# Altium project MC Alarm.PrjPcb
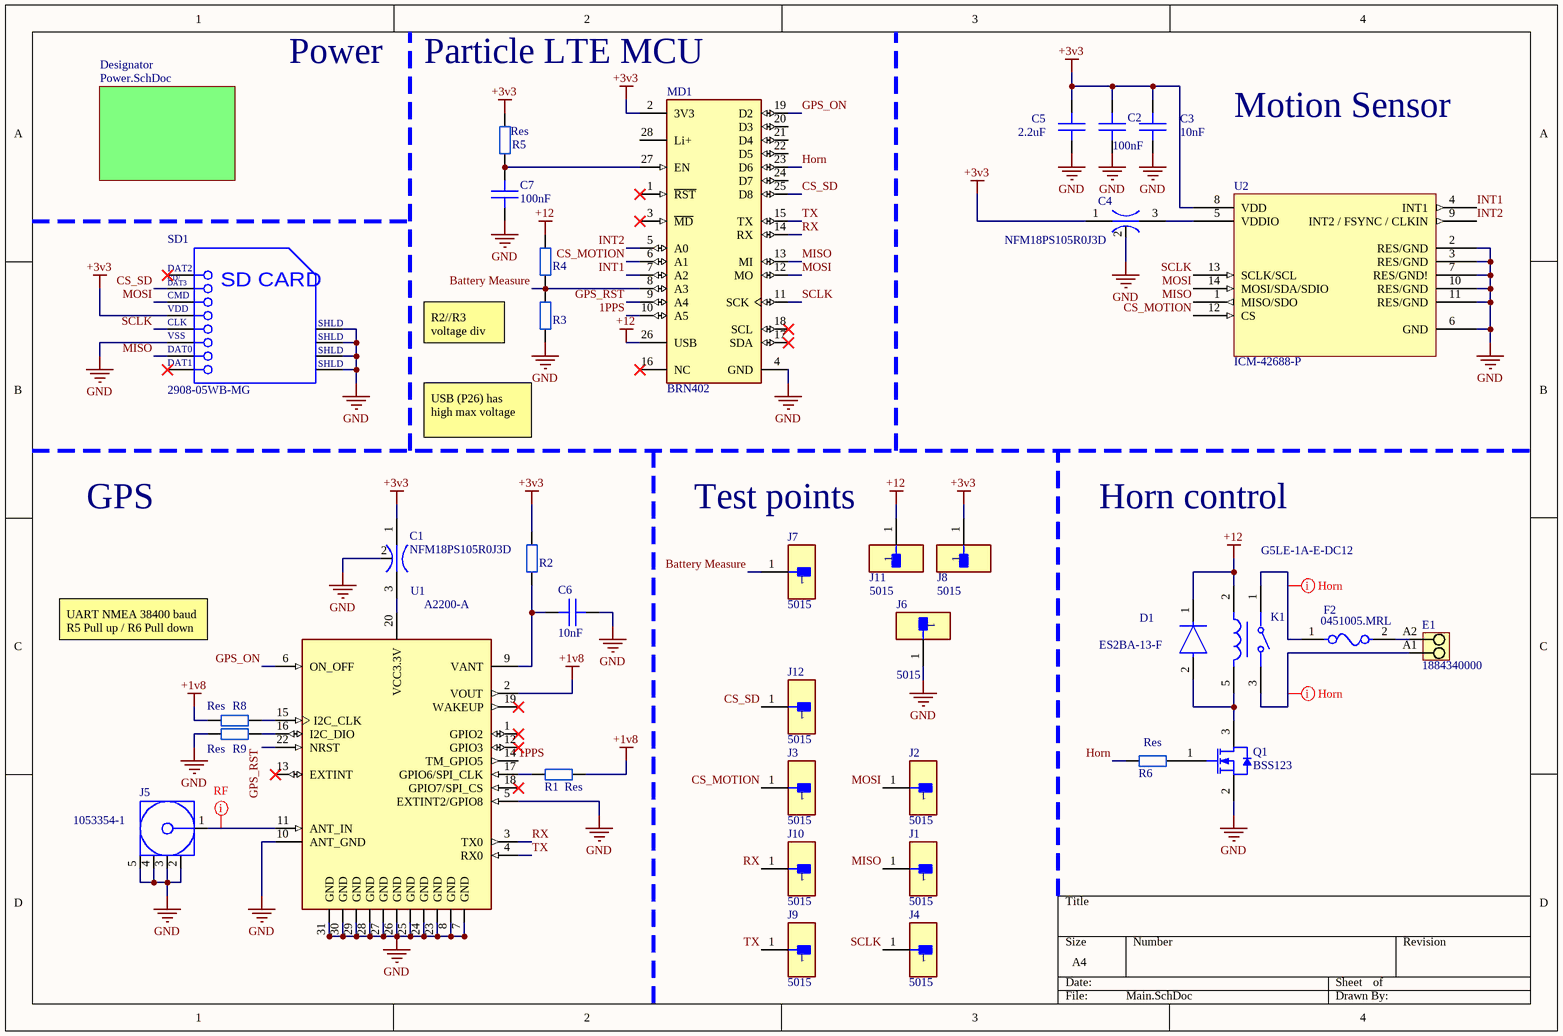
[diagram p0: Main.SchDoc]
2 sheets, 44 parts. Net scope: global (net labels, ports and power ports of the same name join across sheets).
Board file: PCB.PcbDoc
Sheets:
  Main.SchDoc
    Designator = Power.SchDoc

## Sheet Main.SchDoc
size A4; SheetNumber: 1; SheetTotal: 2

### Parts
C1  NFM18PS105R0J3D  [FP-NFM18-0_1-e0_05_0_35-MFG]
C2  value 100nF  [C0603 (1608)]  (hidden comment: Cap SMD)
C3  value 10nF  [C0603 (1608)]  (hidden comment: Cap SMD)
C4  NFM18PS105R0J3D  [FP-NFM18-0_1-e0_05_0_35-MFG]
C5  value 2.2uF  [C0603 (1608)]  (hidden comment: Cap SMD)
C6  value 10nF  [C0603 (1608)]  (hidden comment: Cap SMD)
C7  value 100nF  [C0603 (1608)]  (hidden comment: Cap SMD)
D1  ES2BA-13-F  [FP-SMA-MFG]
E1  1884340000  [LSF_SMT_5_00_135_02]
F2  0451005.MRL  [FP-0451-MFG]
J1  5015  [FP-5015-MFG]
J2  5015  [FP-5015-MFG]
J3  5015  [FP-5015-MFG]
J4  5015  [FP-5015-MFG]
J5  1053354-1  [TECO-1053354-1_V]
J6  5015  [FP-5015-MFG]
J7  5015  [FP-5015-MFG]
J8  5015  [FP-5015-MFG]
J9  5015  [FP-5015-MFG]
J10  5015  [FP-5015-MFG]
J11  5015  [FP-5015-MFG]
J12  5015  [FP-5015-MFG]
K1  G5LE-1A-E-DC12  [FP-G5LE-1A-E-DC12-MFG]
MD1  BRN402  [FP-BRN402-0]
Q1  BSS123  [FAIR-SOT23-3_V]
R1  Res  [R0603 (1608)]
R2  Res  [R0603 (1608)]  (value not drawn)
R3  Res  [R0603 (1608)]  (value not drawn)
R4  Res  [R0603 (1608)]  (value not drawn)
R5  Res  [R0603 (1608)]
R6  Res  [R0603 (1608)]
R8  Res  [R0603 (1608)]
R9  Res  [R0603 (1608)]
SD1  2908-05WB-MG  [3M-2908-05WB-MG_V]
U1  A2200-A  [XCVR_A2200-A]
U2  ICM-42688-P  [ICM-42688-P]

### Sub-sheets
Designator = Power.SchDoc: no entries

### Nets
+1v8: R1.1 R8.2 U1.2(VOUT)
+3v3: C1.1(Input) C2.2 C3.2 C4.1(Input) C5.2 J8.1 MD1.2(3V3) R2.2 R5.2 SD1.4(VDD) U2.8(VDD)
+12: D1.1(C) J11.1 K1.2 MD1.26(USB) R4.2
GND: C1.2(GND) C2.1 C3.1 C4.2(GND) C5.1 C6.1 C7.1 J5.2 J5.3 J5.4 J5.5 J6.1 MD1.4(GND) Q1.2(S) R3.1 R9.2 SD1.6(VSS) SD1.9(SHLD) SD1.10(SHLD) SD1.11(SHLD) SD1.12(SHLD) U1.5(EXTINT2/GPIO8) U1.7(GND) U1.8(GND) U1.10(ANT_GND) U1.23(GND) U1.24(GND) U1.25(GND) U1.26(GND) U1.27(GND) U1.28(GND) U1.29(GND) U1.30(GND) U1.31(GND) U2.2(RES/GND) U2.3(RES/GND) U2.6(GND) U2.7(RES/GND!) U2.10(RES/GND) U2.11(RES/GND)
1PPS: MD1.10(A5) U1.14(TM_GPIO5)
Battery Measure: J7.1 MD1.8(A3) R3.2 R4.1
CS_MOTION: J3.1 MD1.6(A1) U2.12(CS)
CS_SD: J12.1 MD1.25(D8) SD1.2(CD/DAT3)
GPS_ON: MD1.19(D2) U1.6(ON_OFF)
GPS_RST: MD1.9(A4) U1.22(NRST)
Horn: MD1.23(D6) R6.2
INT1: MD1.7(A2) U2.4(INT1)
INT2: MD1.5(A0) U2.9(INT2_/_FSYNC_/_CLKIN)
MISO: J1.1 MD1.13(MI) SD1.7(DAT0) U2.1(MISO/SDO)
MOSI: J2.1 MD1.12(MO) SD1.3(CMD) U2.14(MOSI/SDA/SDIO)
RX: J10.1 MD1.14(RX) U1.3(TX0)
SCLK: J4.1 MD1.11(SCK) SD1.5(CLK) U2.13(SCLK/SCL)
TX: J9.1 MD1.15(TX) U1.4(RX0)
NetC1_3: C1.3(Output) U1.20(VCC3.3V)
NetC4_3: C4.3(Output) U2.5(VDDIO)
NetC6_2: C6.2 R2.1 U1.9(VANT)
NetC7_2: C7.2 MD1.27(EN) R5.1
NetD1_2: D1.2(A) K1.5 Q1.3(D)
NetE1_A1: E1.A1 K1.3
NetE1_A2: E1.A2 F2.2
NetF2_1: F2.1 K1.1
NetJ5_1: J5.1 U1.11(ANT_IN)
NetQ1_1: Q1.1(G) R6.1
NetR1_2: R1.2 U1.17(GPIO6/SPI_CLK)
NetR8_1: R8.1 U1.15(I2C_CLK)
NetR9_1: R9.1 U1.16(I2C_DIO)

Not connected (* = marked no-connect by the designer): MD1 1(~{RST})* 3(~{MD})* 16(NC)* 17(SDA)* 18(SCL)* 20(D3) 21(D4) 22(D5) 24(D7) 28(Li+); SD1 1(DAT2)* 8(DAT1)*; U1 1(GPIO2)* 12(GPIO3)* 13(EXTINT)* 18(GPIO7/SPI_CS)* 19(WAKEUP)*

### Layout directives
net class High Power: NetE1_A1, NetF2_1
net class RF: NetJ5_1

### Notes on the sheet
- Power
- Particle LTE MCU
- Motion Sensor
- R2//R3 voltage div
- USB (P26) has high max voltage
- GPS
- (near J11) Test points
- Horn control
- UART NMEA 38400 baud
  R5 Pull up / R6 Pull down
- (in symbol CMP-2000-05030-1) CD/; DAT3; SD CARD

### Library data of the parts
C1 C4 = CMP-2000-06844-3: Large Current 3 Terminals Low ESL Chip Multilayer Ceramic Capacitors for General Purpose, 0603, 1uF, 20%, 6.3V; Current Rating: 2A; DC Resistance (DCR): 30mR; Insulation Resistance: 500MR; Max Voltage Rating (DC): 6.3V; Voltage: 6.3V; Weight: 7.1E-05oz; Height: 0.6mm; Lead Free: Lead Free; REACH SVHC: No SVHC; Max Operating Temperature: 105°C; Min Operating Temperature: -55°C; Mount: Surface Mount; Capacitance: 1uF; Width: 0.8mm; Radiation Hardening: No; Max Current Rating: 2A; Case Code (Imperial): 0603; Voltage Rating (DC): 6.3V; Length: 1.6mm; Case/Package: 0603; Case Code (Metric): 1608; Package Quantity: 1; Tolerance: 20%; Current: 2A; Packaging: Tape and Reel; Depth: 0.8mm; Voltage Rating: 6.3V; Termination: Flat
D1 = CMP-12791-000037-1: DIODE GEN PURP 100V 2A SMA; Manufacturer: Diodes Inc.; Standoff Height: 0.05mm; Value: 25pF; Peak Reverse Current: 5uA; Max Junction Temp: +150°C; Max Surge Forward Current: 50A; Digikey Description: DIODE GEN PURP 100V 2A SMA; Max Repetitive Reverse Voltage: 100V; Mouser Description: ES2BA Series 100 V 2 A Surface Mount Super-Fast Rectifier - DO-214AC; RoHS: TRUE; Device Class L3: Rectifier Diodes; Height: 2.4mm; Footprint Url: https://www.diodes.com/assets/Package-Files/SMA.pdf; Lead Free: Yes; Device Class L1: Discrete Semiconductors; Forward Current: 2A; ComponentLink2Description: Datasheet; Manufacturer Part Number: ES2BA-13-F; Temperature: -55°C to +150°C; Temperature Range Low: -55°C; Automotive: No; Device Class L2: Diodes; Category: Diode; Octopart: https://octopart.com/es2ba-13-f-diodes+inc.-14402013; Package: SMA; Capacitance: 25pF; ComponentLink2URL: https://www.diodes.com/assets/Datasheets/ds14002.pdf; Reverse Voltage: 100V; Temperature Range High: +150°C
E1 = CMP-1559-02276-1: OMNIMATE Signal - series LSF; Manufacturer: Weidmueller; Rated_voltage_for_surge_voltage_class_pollution_degree_II_2: 500 V; Pitch_mm: 5 mm; Wire_cross_section_AWG_min_UL_1059: AWG 24; Insulating_material: LCP GF; Rated_voltage_use_group_B_UL_1059: 300 V; Rated_current_use_group_B_UL_1059: 12 A; Mounting_onto_the_PCB: Reflow solder connection; Contact_material: Cu-Leg; Short_text_for_material: LSF-SMT 5.00/02/135 3.5SN BK TU; No_of_poles: 2; UL_94_flammability_rating: V-0; Solid_min_H05_07_V_U: 0,2 mm²; Contact_surface: tinned; Side_termination_characteristic: closed side; Wire_cross_section_AWG_max_UL_1059: AWG 16; Solder_pin_length_mm: 3,5 mm; Pitch_inch: 0,197 inch; Solid_max_H05_07_V_U: 1,5 mm²; Rated_current_min_no_of_poles_TU_20_deg_C: 19 A; Packaging: Tube; ComponentLink1URL: http://www.weidmueller.com/; ComponentLink2URL: http://catalog.weidmueller.com/catalog/Start.do?localeId=en&ObjectID=1884340000; PackageReference: LSF_SMT_5_00_135_02; PartNumber: 1884340000; ComponentLink1Description: Manufacturer URL; Qty: 60 PCS; Colour: Black; Revision: V1; ComponentLink2Description: URL Link1
F2 = CMP-2000-05653-2: FUSE BRD MNT 5A 125VAC/VDC 2SMD; Manufacturer: Littelfuse Inc; Fuse Blow Speed: Fast; Voltage Rating: 125V; Fuse Interrupt Ac Current: 50A; Value: 0.0125Ω; Fuse I2T: 5.566A2Sec; Device Class L3: unset; Temperature Range Low: -55°C; Height: 2.94mm; Category: Fuse; Fuse Current: 5A; Octopart: https://octopart.com/0451005.mrl-littelfuse-566389; Package: 0451; RoHS: TRUE; Manufacturer Part Number: 0451005.MRL; Mouser Description: Surface Mount Fuses 125V 5A; Device Class L2: Fuses; ComponentLink2URL: https://www.littelfuse.com/~/media/electronics/datasheets/fuses/littelfuse_fuse_451_453_datasheet.pdf.pdf; Temperature Range High: +125°C; Digikey Description: FUSE BRD MNT 5A 125VAC/VDC 2SMD; Device Class L1: Circuit Protection; Automotive: No; Fuse Interrupt Dc Current: 50A; Temperature: -55°C to +125°C; Max Fuse Dc Voltage: 125V; Resistance: 0.0125Ω; ComponentLink2Description: Datasheet; Max Fuse Ac Voltage: 125V; Lead Free: Yes
J1-J4 J6-J12 = CMP-2000-05183-2: PC TEST POINT MINIATURE; Manufacturer: keystone; Number Of Contacts: 1; Conn Orientation: Straight; Category: Conn; Manufacturer Part Number: 5015; Digikey Description: PC TEST POINT MINIATURE; Automotive: No; Lead Free: Yes; Octopart: https://octopart.com/5015-keystone-3822; ComponentLink2URL: http://www.keyelco.com/product-pdf.cfm?p=1353; Package: 5015; RoHS: TRUE; Device Class L3: unset; Device Class L2: unset; Contact Material: Silver; Device Class L1: Connectors; Height: 1.65mm; ComponentLink2Description: Datasheet
J5 = CMP-2000-05830-1: Female Coaxial Connector, Pitch 2.55 mm, Height 9.5 mm, Tail Length 3.9 mm, RoHS, Bulk; Manufacturer: TE Connectivity; Dynamic Catalog: SMA; Impedance: 50Ohm; Contact Termination: Solder; Connector Type: Jack,FemaleSockets; 3D Model: 1053354-1.pdf; Other Names: 2062000000 / A30046; Datasheet Version: Rev. B, 05/2011; Package Reference: 1053354-1; RoHS Information: 1053354-1StatementofCompliance; Series: SMA; Connector Style: SMA; Family: CoaxialConnectors(RF); Category: Connectors,Interconnects; Fastening Type: Threaded; Standard Package: 125; Mounting Type: ThroughHole; Packaging: Bulk; Datasheet URL: http://www.te.com/commerce/DocumentDelivery/DDEController?Action=srchrtrv&DocNm=1053354&DocType=Customer+Drawing&DocLang=English; Mounting Technology: ThroughHole; Manufacturer URL: http://www.te.com/; Package Description: Female Coaxial Connector, Pitch 2.55 mm, Height 9.5 mm, Tail Length 3.9 mm
K1 = CMP-08822-000128-1: RELAY GEN PURPOSE SPST 16A 12V; Operate Time: 10ms; Coil Power: 400mW; Coil Current: 33.3mA; Voltage Rating (AC): 250V; Coil Type: Non-Latching; Relay Type: General Purpose; Coil Resistance: 360R; Release Time: 5ms; Packaging: Tray; Lead Free: Lead Free; Coil Voltage (DC): 12V; Max Operating Temperature: 85°C; Max Current Rating: 16A; Series: G5LE; Depth: 16.5mm; Contact Current Rating: 16A; Throw Configuration: SPST; Height: 19mm; Width: 16.5mm; Min Operating Temperature: -40°C; Max Voltage Rating (AC): 250V; Termination: Solder; Length: 22.5mm; Weight: 12g; Number of Pins: 4; Power Consumption: 400mW; Contact Material: Tin; Package Quantity: 100; Mount: Through Hole; RoHS Compliant: Yes
MD1 = CMP-201502-000001-1: BORON LTE; Manufacturer: Particle; Number Of Adc Channels: 6; Data Rate: 2000kbits/s; Max Frequency: 3000MHz; Min Supply Voltage: 3V; Interface: I2C,SPI,UART,USB; Max Supply Voltage: 4.4V; Bandwidth: 2302MHz; Nominal Supply Current: 70-100000uA; Number Of Gpio: 20; Category: UNK; Temperature Range Low: -20°C; Temperature: -20°C to +60°C; Package: BRN402; Automotive: No; Device Class L2: RF Semiconductors and Devices; ComponentLink2Description: Datasheet; Manufacturer Part Number: BRN402; ComponentLink2URL: https://docs.particle.io/assets/pdfs/datasheets/boron-datasheet.pdf; Lead Free: Yes; Device Class L3: Transceivers; RoHS: TRUE; Octopart: https://octopart.com/brn402-particle-96116406; Device Class L1: Integrated Circuits (ICs); Digikey Description: BORON LTE; Temperature Range High: +60°C
Q1 = CMP-2000-04934-1: N-Channel Logic Level Enhancement Mode Field Effect Transistor, 1.7 V, -55 to 150 degC, 3-Pin SOT-23, RoHS, Tape and Reel; Manufacturer: Fairchild; Channel Type: N; Typical Turn-Off Delay Time: 17ns; Maximum Continuous Drain Current: 0.17A; Rad Hard: No; Typical Rise Time: 9ns; Typical Fall Time: 2.4ns; Maximum Gate Source Voltage: ±20V; Maximum Drain Source Voltage: 100V; Typical Turn-On Delay Time: 1.7ns; RDS-on: 6000@10VmOhm; Package Version: Rev. 12, 03/2016; Packaging: Tape&Reel; Package Reference: SOT23-3; Channel Mode: Enhancement; Operating Temperature: -55to150degC; Package Description: 3-Pin Small Outline Transistor, Body 2.92 x 1.325 mm, Pitch 0.95 mm; Category: MOSFET; Datasheet Version: Jun-03; Datasheet URL: https://www.fairchildsemi.com/datasheets/BS/BSS123.pdf; Manufacturer URL: https://www.fairchildsemi.com/; Mounting: SurfaceMount; Package: 3SOT-23; Package URL: http://www.fairchildsemi.com/dwg/MA/MA03D.pdf
R1-R6 R8 R9 = Resistor EU
SD1 = CMP-2000-05030-1: Card Connector Micro-SD, 500 VAC, 100 mOhm Min, 0.5 A, RoHS, Tape and Reel; Manufacturer: 3M; Connector Type: ConnectorandEjector; Other Related Documents: SDCardDateCodeDecipher; Insertion, Removal Method: PushIn,PushOut; Other Names: 3M5607CT; PCN Obsolescence/ EOL: 2908Series30/Jun/2010; Number of Positions: 10(8+2); Card Type: SecureDigital-microSD™; Online Catalog: 2900Series; Featured Product: 3MCardConnectormicroSD; Features: Switch; Packaging: CutTape(CT); Package Reference: 2908-05WB-MG; Package Description: 8-Pin Surface Mount Device, Body 15.2 x 14 mm, Pitch 1.1 mm; Contact Finish: Gold; Catalog Drawings: 2908-05WB-MG; Mounting Feature: Normal,Standard-Top; Series: 2900; Datasheet Version: Oct-06; Datasheet URL: http://datasheet.octopart.com/2908-05WB-MG-3M-datasheet-6398107.pdf; Contact Finish Thickness: 15µin(0.38µm); Manufacturer URL: http://www.3m.com/; Family: MemoryConnectors-PCCardSockets; Category: Connectors,Interconnects; Standard Package: 1; Mounting Type: SurfaceMount,RightAngle; Ejector Side: -; Height Above Board: 0.073"(1.85mm)
U1 = A2200-A: SiRFstarIVâ„¢ RF Receiver GPS 1.575GHz -163dBm 115.2kbps Module; MF: Maestro Wireless; SnapEDA_Link: https://www.snapeda.com/parts/A2200-A/Maestro%20Wireless%20Solutions/view-part/51723/?ref=snap; Availability: Unavailable; MP: A2200-A; Price: None; Value: *; Package: Module Maestro Wireless

## Sheet Power.SchDoc
size A4; SheetNumber: 2; SheetTotal: 2
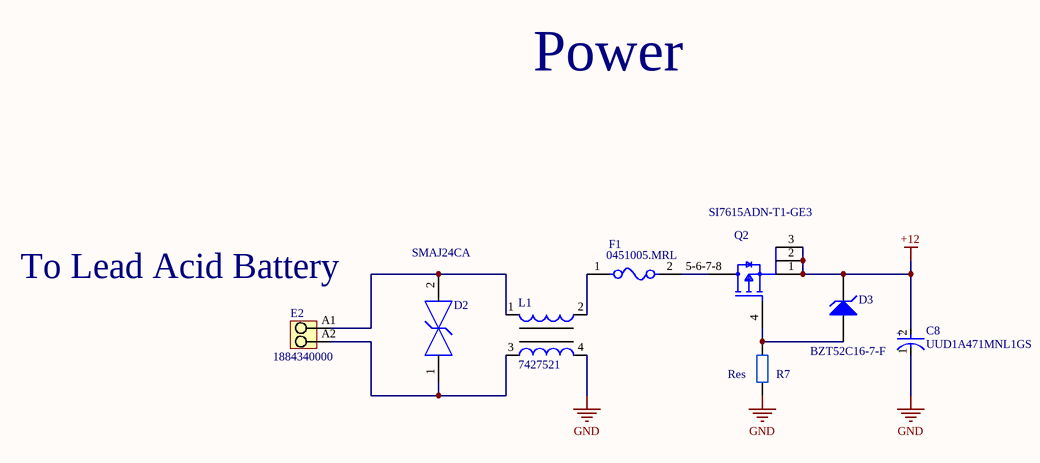
[diagram p1: Power.SchDoc]

### Parts
C8  UUD1A471MNL1GS  [FP-UUD1A471MNL1GS-MFG]
D2  SMAJ24CA  [FP-SMAJ-CA-MFG]
D3  BZT52C16-7-F  [DIOD-SOD123-2_V]
E2  1884340000  [LSF_SMT_5_00_135_02]
F1  0451005.MRL  [FP-0451-MFG]
L1  7427521  [WE-CMS]
Q2  SI7615ADN-T1-GE3  [FP-S16-2667_SINGLE-MFG]
R7  Res  [R0603 (1608)]

### Nets
+12: C8.2(A) D3.2(K) Q2.1(S) Q2.2(S) Q2.3(S)
GND: C8.1(C) L1.4 R7.1
NetD2_1: D2.1 E2.A2 L1.3
NetD2_2: D2.2 E2.A1 L1.1
NetD3_1: D3.1(A) Q2.4(G) R7.2
NetF1_1: F1.1 L1.2
NetF1_2: F1.2 Q2.5-6-7-8(D)

### Notes on the sheet
- Power
- To Lead Acid Battery
- (in symbol CMP-0687-00070-2) +

### Library data of the parts
C8 = CMP-0687-00070-2: CAP ALUM 470UF 20% 10V SMD; Leakage Current: 3uA; Lead Diameter: 1.1mm; Ripple Current: 450mA; Dissipation Factor: 0.24%; Life (Hours): 5000Hour; Dielectric Material: Aluminium; Impedance: 170mR; Voltage Rating: 10V; Height - Seated (Max): 0.394inch; Packaging: Tape and Reel; Voltage Rating (DC): 10V; Package Quantity: 500; Radiation Hardening: No; Capacitance: 470uF; Min Operating Temperature: -55°C; Max Operating Temperature: 105°C; REACH SVHC: No SVHC; Tolerance: 20%; Termination: SMD/SMT; Lead Free: Lead Free; Diameter: 8mm; Case/Package: Radial; Length: 10mm; Voltage: 10V; Ripple Current (AC): 450mA; Height: 10mm; Lead Pitch: 3.1mm; Number of Pins: 2
D2 = CMP-2000-07087-2: TVS DIODE 24V 38.9V DO214AC; Manufacturer: Littelfuse; Peak Pulse Power: 400W; Direction: Bidirectional; Breakdown Voltage: 26.7V; Max Junction Temp: +150°C; Number Of Channels: 1; Peak Pulse Current: 10.3A; Digikey Description: TVS DIODE 24V 38.9V DO214AC; Temperature Range Low: -65°C; Temperature: -65°C to +150°C; Manufacturer Part Number: SMAJ24CA; Octopart: https://octopart.com/smaj24ca-littelfuse-350011; Height: 2.29mm; Clamping Voltage: 38.9V; Device Class L1: Circuit Protection; Automotive: No; Device Class L2: TVS Diodes; Package: SMAJ-CA; ComponentLink2URL: https://www.littelfuse.com/~/media/electronics/datasheets/tvs_diodes/littelfuse_tvs_diode_smaj_datasheet.pdf.pdf; RoHS: TRUE; Temperature Range High: +150°C; Category: Diode; Lead Free: Yes; Reverse Standoff Voltage: 24V; Device Class L3: unset; ComponentLink2Description: Datasheet; Mouser Description: In a Pack of 25, Littelfuse SMAJ24CA, Bi-Directional TVS Diode, 400W, 2-Pin DO-214AC
D3 = CMP-0860-00001-1: Surface Mount Zener Diode, 16 V, -65 to 125 degC, SOD123, RoHS, Tape and Reel; Manufacturer: Diodes Inc; Maximum Reverse Current: 0.1 uA; Tol V: 5.56% Typ.; Maximum Zener Impedance f: 1 kHz ZZK=200 Ohm; Voltage Zener: 16 V Typ.; Power Max: 500 mW; ComponentLink2URL: http://www.diodes.com/datasheets/ds18004.pdf; PackageDescription: 2-Pin SOD123, Body 2.7 x 1.55 mm, Height 1.45 mm; ComponentLink3Description: Package Specification; Mounting Technology: Surface Mount; PackageReference: SOD123; ComponentLink2Description: Datasheet; RoHS: TRUE; ComponentLink3URL: http://www.diodes.com/datasheets/ap02002.pdf; Operating Temperature: -65 to 150 degC; DatasheetVersion: Rev. 37-2; Packing: Tape and Reel; ComponentLink1Description: Manufacturer URL; ComponentLink1URL: http://www.diodes.com/; PackageVersion: Rev. 79; PartNumber: BZT52C16-7-F
E2 = CMP-1559-02276-1: as E1 on sheet Main; Packaging: Tube; ComponentLink1URL: http://www.weidmueller.com/; ComponentLink2URL: http://catalog.weidmueller.com/catalog/Start.do?localeId=en&ObjectID=1884340000; PackageReference: LSF_SMT_5_00_135_02; PartNumber: 1884340000; ComponentLink1Description: Manufacturer URL; Qty: 60 PCS; Colour: Black; Revision: V1; ComponentLink2Description: URL Link1
F1 = CMP-2000-05653-2: as F2 on sheet Main; Device Class L3: unset; Temperature Range Low: -55°C; Height: 2.94mm; Category: Fuse; Fuse Current: 5A; Octopart: https://octopart.com/0451005.mrl-littelfuse-566389; Package: 0451; RoHS: TRUE; Manufacturer Part Number: 0451005.MRL; Mouser Description: Surface Mount Fuses 125V 5A; Device Class L2: Fuses; ComponentLink2URL: https://www.littelfuse.com/~/media/electronics/datasheets/fuses/littelfuse_fuse_451_453_datasheet.pdf.pdf; Temperature Range High: +125°C; Digikey Description: FUSE BRD MNT 5A 125VAC/VDC 2SMD; Device Class L1: Circuit Protection; Automotive: No; Fuse Interrupt Dc Current: 50A; Temperature: -55°C to +125°C; Max Fuse Dc Voltage: 125V; Resistance: 0.0125Ω; ComponentLink2Description: Datasheet; Max Fuse Ac Voltage: 125V; Lead Free: Yes
L1 = CMP-0220-00057-1: Common Mode SMD Bead WE-CMS, Z = 52 Ohm; Impedance: 52 Ohm; PackageReference: WE-CMS; PackageVersion: 2010; ComponentLink1URL: http://www.we-online.com; PackageDescription: Inductor, 4-Leads, Body 8.5 x 5.6 mm; ComponentLink2Description: Datasheet; ComponentLink2URL: http://www.we-online.de/katalog/media/pdf/7427521.pdf; DatasheetVersion: ver 8, Jul-2010; ComponentLink1Description: Manufacturer Link
Q2 = CMP-02550-000167-1: MOSFET P-CH 20V 35A 1212-8S; Manufacturer: Vishay; Gate Charge At Vgs: 122nC @ -10V; Max Forward Diode Voltage: -1.1V; Continuous Drain Current: -22.1A; Gate To Source Voltage: 12V; Number Of P Channels: 1; Pulse Drain Current: -80A; Threshold Vgs Max: -1.5V; Drain To Source Voltage: -20V; Reverse Recovery Time: 27ns; Depletion Mode: False; Reverse Recovery Charge: 11nC; Power Dissipation: 3.7W; Rthja Max: 33°C/W; Typ Forward Diode Voltage: -0.72V; Standoff Height: 0mm; Input Capacitace At Vds: 5590pF @ -10V; Turn On Delay Time: 13ns; Turn Off Delay Time: 85ns; Max Junction Temp: +150°C; Transconductance: 82S; Threshold Vgs Min: -0.4V; Drain To Source Resistance: 0.0035Ω; Manufacturer Part Number: SI7615ADN-T1-GE3; Package: S16-2667_SINGLE; Height: 1.12mm; Automotive: No; Device Class L3: MOSFETs; Device Class L1: Discrete Semiconductors; Digikey Description: MOSFET P-CH 20V 35A 1212-8S; Category: Trans; Device Class L2: Transistors; Drain To Source Breakdown Voltage: -20V; Temperature Range High: +150°C; Octopart: https://octopart.com/si7615adn-t1-ge3-vishay-45331111; Number Of Channels: 1; RoHS: TRUE; Temperature: -55°C to +150°C; ComponentLink2URL: http://www.vishay.com/docs/62667/si7615adn.pdf; Temperature Range Low: -55°C; Lead Free: Yes; ComponentLink2Description: Datasheet; Mouser Description: MOSFET -20V 4.4mOhm@10V 35A P-Ch G-III
R7 = Resistor EU

## Nets that join several sheets
+12: Main (5 pins), Power (5 pins)
GND: Main (40 pins), Power (C8.1 L1.4 R7.1)